# EAGLE design TickTagREV4 (EAGLE 9.5.2)
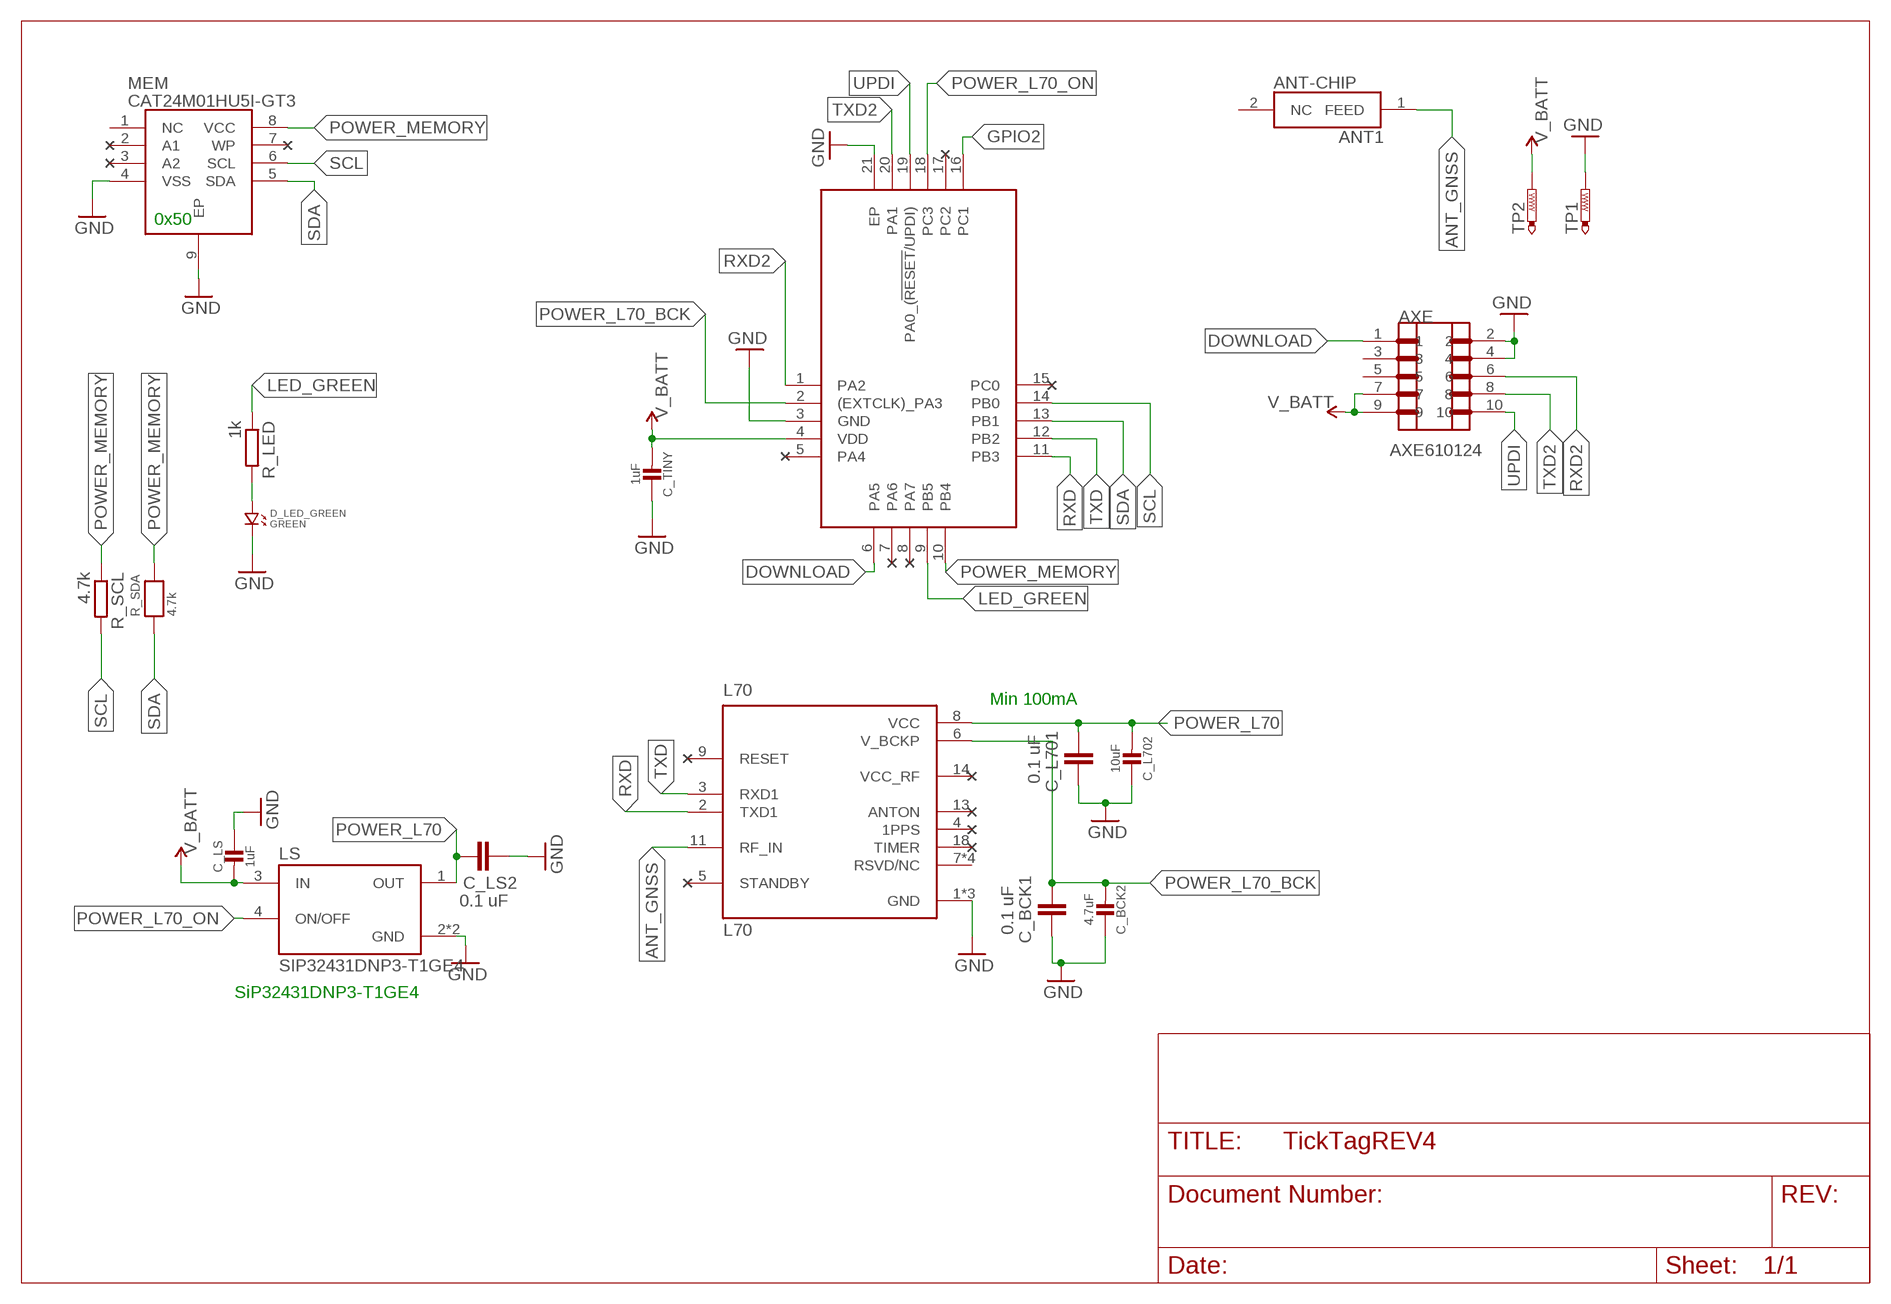
[diagram p0: schematic, sheet 1]

## Parts
ANT-CHIP  ANT1  SAMACSYS_PARTS_1575AT43A0040E  [SAMACSYS_PARTS_1575AT43A0040E]
ATTINY  ATTINY1616-MFR  [QFN40P300X300X90-21N]
AXE  AXE610124  [AXE610124]
C_BCK1  0.1 uF  C-EUC0201  [C0201]
C_BCK2  4.7uF  MICROBUILDER_CAP_CERAMIC_0402MP  [MICROBUILDER__0402MP]
C_L701  0.1 uF  C-EUC0201  [C0201]
C_L702  10uF  MICROBUILDER_CAP_CERAMIC_0402MP  [MICROBUILDER__0402MP]
C_LS  1uF  MICROBUILDER_CAP_CERAMIC_0402MP  [MICROBUILDER__0402MP]
C_LS2  0.1 uF  C-EUC0201  [C0201]
C_TINY  1uF  MICROBUILDER_CAP_CERAMIC_0402MP  [MICROBUILDER__0402MP]
D_LED_GREEN  GREEN  CMONR_STANDARDPARTS_LED.0402  [CMONR_STANDARDPARTS_0402.LED]
L70  L70  [XCVR_L70]
LS  SIP32431DNP3-T1GE4  [SON50P120X160X60-5N]
MEM  CAT24M01HU5I-GT3  [SON50P300X200X55-9N]
R_LED  1k  R-EU_R0201  [R0201]
R_SCL  4.7k  R-EU_R0201  [R0201]
R_SDA  4.7k  MICROBUILDER_RESISTOR_0402MP  [MICROBUILDER__0402MP]
TP1  PTR1TP13SQ  [TP13SQ]
TP2  PTR1TP13SQ  [TP13SQ]

## Nets
ANT_GNSS: ANT-CHIP.1(FEED) L70.11(RF_IN)
DOWNLOAD: ATTINY.6(PA5) AXE.1
GND: ATTINY.3(GND) ATTINY.21(EP) AXE.2 AXE.4 C_BCK1.2 C_BCK2.1 C_L701.2 C_L702.1 C_LS2.2 C_LS.1 C_TINY.1 D_LED_GREEN.P$2 L70.1(GND) L70.10(GND) L70.12(GND) LS.2(GND) LS.5(GND) MEM.4(VSS) MEM.9(EP) TP1.TP
GPIO2: ATTINY.16(PC1)
LED_GREEN: ATTINY.9(PB5) R_LED.1
N$9: D_LED_GREEN.P$1 R_LED.2
POWER_L70: C_L701.1 C_L702.2 C_LS2.1 L70.8(VCC) LS.1(OUT)
POWER_L70_BCK: ATTINY.2((EXTCLK)_PA3) C_BCK1.1 C_BCK2.2 L70.6(V_BCKP)
POWER_L70_ON: ATTINY.18(PC3) LS.4(ON/OFF)
POWER_MEMORY: ATTINY.10(PB4) MEM.8(VCC) R_SCL.1 R_SDA.2
RXD: ATTINY.11(PB3) L70.2(TXD1)
RXD2: ATTINY.1(PA2) AXE.6
SCL: ATTINY.14(PB0) MEM.6(SCL) R_SCL.2
SDA: ATTINY.13(PB1) MEM.5(SDA) R_SDA.1
TXD: ATTINY.12(PB2) L70.3(RXD1)
TXD2: ATTINY.20(PA1) AXE.8
UPDI: ATTINY.19(PA0_(!RESET!/UPDI)) AXE.10
V_BATT: ATTINY.4(VDD) AXE.7 AXE.9 C_LS.2 C_TINY.2 LS.3(IN) TP2.TP
Unconnected: ANT-CHIP.2(NC) ATTINY.5(PA4) ATTINY.7(PA6) ATTINY.8(PA7) ATTINY.15(PC0) ATTINY.17(PC2) AXE.3 AXE.5 L70.4(1PPS) L70.5(STANDBY) L70.7(RSVD/NC) L70.9(RESET) L70.13(ANTON) L70.14(VCC_RF) L70.15(RSVD/NC) L70.16(RSVD/NC) L70.17(RSVD/NC) L70.18(TIMER) MEM.1(NC) MEM.2(A1) MEM.3(A2) MEM.7(WP)

## Notes on the sheet
- 0x50
- Min 100mA
- SiP32431DNP3-T1GE4

## Library data of the parts
ANT-CHIP = 1575AT43A0040E_V2:SAMACSYS_PARTS_1575AT43A0040E: Tri-Band GPS, BDS, and GLNSS, Low Cost, Linearly Polarized, Omnidirectional Chip Antenna Source: Datasheet <https://componentsearchengine.com/Datasheets/1/1575AT43A0040E.pdf>; DESCRIPTION: Tri-Band GPS, BDS, and GLNSS, Low Cost, Linearly Polarized, Omnidirectional Chip Antenna; HEIGHT: mm; MANUFACTURER_NAME: JOHANSON TECHNOLOGY; MANUFACTURER_PART_NUMBER: 1575AT43A0040E; MOUSER_PART_NUMBER: 609-1575AT43A0040E; MOUSER_PRICE-STOCK: https://www.mouser.com/Search/Refine.aspx?Keyword=609-1575AT43A0040E
ATTINY = ATTINY1616-MFR:ATTINY1616-MFR: 8-bit Microcontrollers - MCU 20MHz, 16KB, VQFN20, Ind 125C, Green, T&R Source: Datasheet <http://ww1.microchip.com/downloads/en/DeviceDoc/ATtiny806_1606_Data_Sheet_40002029A.pdf>; DESCRIPTION: 8-bit Microcontrollers - MCU 20MHz, 16KB, VQFN20, Ind 125C, Green, T&R; HEIGHT: 0.9mm; MANUFACTURER_NAME: Microchip; MANUFACTURER_PART_NUMBER: ATTINY1606-MFR; MOUSER_PART_NUMBER: 556-ATTINY1606-MFR; MOUSER_PRICE-STOCK: https://www.mouser.com/Search/Refine.aspx?Keyword=556-ATTINY1606-MFR
AXE = PanasonicA4SConnectorsV7:AXE610124
C_BCK1 C_L701 C_LS2 = rcl:C-EU: CAPACITOR, European symbol; SPICEPREFIX: C
C_BCK2 C_L702 C_LS C_TINY = TinyPICO:MICROBUILDER_CAP_CERAMIC: Ceramic Capacitors For new designs, use the packages preceded by an '_' character since they are more reliable: The following footprints should be used on most boards: _0402 - Standard footprint for regular board layouts _0603 - Standard footprint for regular board layouts _0805 - Standard footprint for regular board layouts _1206 - Standard footprint for regular board layouts For extremely tight-pitch boards where space is at a premium, the following 'micro-pitch' footprints can be used (smaller pads, no silkscreen outline, etc.): _0402MP - Micro-pitch footprint for very dense/compact boards _0603MP - Micro-pitch footprint for very dense/compact boards _0805MP - Micro-pitch footprint for very dense/compact boards _1206MP - Micro-pitch footprint for very dense/compact boards
D_LED_GREEN = TinyPICO:CMONR_STANDARDPARTS_LED
L70 = L70LessCream:L70: GPS Module Check prices <https://snapeda.com/parts/L70/Quectel/view-part/?ref=eda>; AVAILABILITY: Bad; DESCRIPTION: L70, an SMD type module, brings the high performance of MTK positioning engine to the industrial applications with compact profile, ultra low power consumption and fast positioning capability.; MF: Quectel; MP: L70; PACKAGE: 2920 Quectel; PRICE: None
LS = SIP32431DNP3-T1GE4:SIP32431DNP3-T1GE4: Power Switch/Driver 1:1 P-Channel 1.4A 4-TDFN (1.2x1.6) Check prices <https://pricing.snapeda.com/parts/SIP32431DNP3-T1GE4/Vishay%20Siliconix/view-part?ref=eda>; AVAILABILITY: In Stock; DESCRIPTION: Power Switch/Driver 1:1 P-Channel 1.4A 4-TDFN (1.2x1.6); MF: Vishay Siliconix; MP: SIP32431DNP3-T1GE4; PACKAGE: UFDFN-4 Vishay Siliconix; PRICE: None; PURCHASE-URL: https://pricing.snapeda.com/search/part/SIP32431DNP3-T1GE4/?ref=eda
MEM = CAT24M01HU5I-GT3-CorrectedV2:CAT24M01HU5I-GT3: EEPROM 1MB I2C SERIAL EEPROM Source: Datasheet <http://www.onsemi.com/pub/Collateral/CAT24M01-D.PDF>; ALLIED_NUMBER: 70300250; ALLIED_PRICE-STOCK: http://www.alliedelec.com/on-semiconductor-cat24m01hu5i-gt3/70300250/; DESCRIPTION: EEPROM 1MB I2C SERIAL EEPROM; HEIGHT: 0.55mm; MANUFACTURER_NAME: ON Semiconductor; MANUFACTURER_PART_NUMBER: CAT24M01HU5I-GT3; MOUSER_PART_NUMBER: 863-CAT24M01HU5I-GT3; MOUSER_PRICE-STOCK: https://www.mouser.com/Search/Refine.aspx?Keyword=863-CAT24M01HU5I-GT3; RS_PART_NUMBER: 7814831P; RS_PRICE-STOCK: http://uk.rs-online.com/web/p/products/7814831P
R_LED R_SCL = rcl:R-EU_: RESISTOR, European symbol; SPICEPREFIX: R
R_SDA = TinyPICO:MICROBUILDER_RESISTOR: Resistors 0402 - 0402 Surface Mount Package 22 Ohm 1% 1/16W [Digikey: 311-22.0LRTR-ND] 33 Ohm 5% 1/16W 1.0K 5% 1/16W 1.5K 5% 1/16W 2.0K 1% 1/16W 10.0K 1% 1/16W [Digikey: 311-10.0KLRTR-ND] 10.0K 5% 1/16W [Digikey: RMCF0402JT10K0TR-ND] 12.1K 1% 1/16W [Digikey: 311-22.0LRTR-ND] 100.0K 5% 1/16W 0603 - 0603 Surface Mount Package 0 Ohm 1/10 Watt 1% Resistor 15 Ohm 1/10 Watt 1% Resistor 33 Ohm 1/10 Watt 1% Resistor 49.9 Ohm 1/10 Watt 1% Resistor 100 Ohm 1/10 Watt 1% Resistor 150 Ohm 1/10 Watt 1% Resistor 240 Ohm 1/10 Watt 1% Resistor 390 Ohm 1/10 Watt 1% Resistor 560 Ohm 1/10 Watt 1% Resistor 680 Ohm 1/10 Watt 1% Resistor 750 Ohm 1/10 Watt 1% Resistor 1.0K Ohm 1/10 Watt 1% Resistor 1.5K Ohm 1/10 Watt 1% Resistor 2.0K Ohm 1/10 Watt 1% Resistor 2.2K Ohm 1/10 Watt 1% Resistor 3.3K Ohm 1/10 Watt 1% Resistor 4.7K Ohm 1/10 Watt 1% Resistor 10.0K Ohm 1/10 Watt 1% Resistor 12.0K Ohm 1/10 Watt 1% Resistor 12.1K Ohm 1/10 Watt 1% Resistor 20.0K Ohm 1/10 Watt 1% Resistor 33.0K Ohm 1/10 Watt 1% Resistor 100.0K Ohm 1/10 Watt 1% Resistor 0805 - 0805 Surface Mount Package 0 Ohm 1/8 Watt 1% Resistor 33 Ohm 1/8 Watt 1% Resistor 100 Ohm 1/8 Watt 1% Resistor 150 Ohm 1/8 Watt 1% Resistor 200 Ohm 1/8 Watt 1% Resistor 240 Ohm 1/8 Watt 1% Resistor 330 Ohm 1/8 Watt 1% Resistor 390 Ohm 1/8 Watt 1% Resistor 470 Ohm 1/8 Watt 1% Resistor 1.0K Ohm 1/8 Watt 1% Resistor 1.5K Ohm 1/8 Watt 1% Resistor 2.0K Ohm 1/8 Watt 1% Resistor 4.7K Ohm 1/8 Watt 1% Resistor 5.1K Ohm 1/8 Watt 1% Resistor 5.6K Ohm 1/8 Watt 1% Resistor 10.0K Ohm 1/8 Watt 1% Resistor 22.0K Ohm 1/8 Watt 1% Resistor 33.0K Ohm 1/8 Watt 1% Resistor 100K Ohm 1/8 Watt 1% Resistor 1206 - 1206 Surface Mount Package 2012 - 2010 Surface Mount Package 0.11 Ohm 1/2 Watt 1% Resistor - Digikey: RHM.11UCT-ND
TP1 TP2 = testpad:PTR1: TEST PIN

## Board
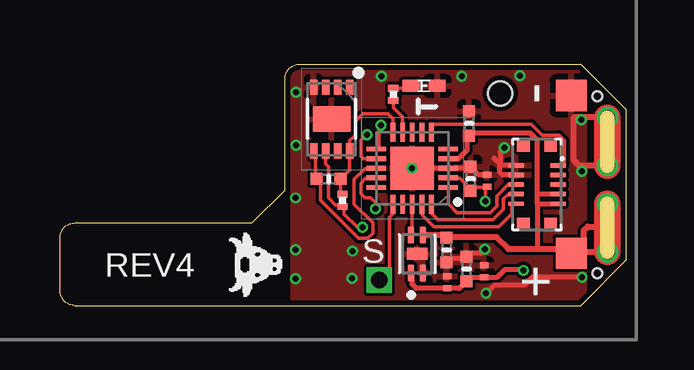
[diagram p1: board, top side]
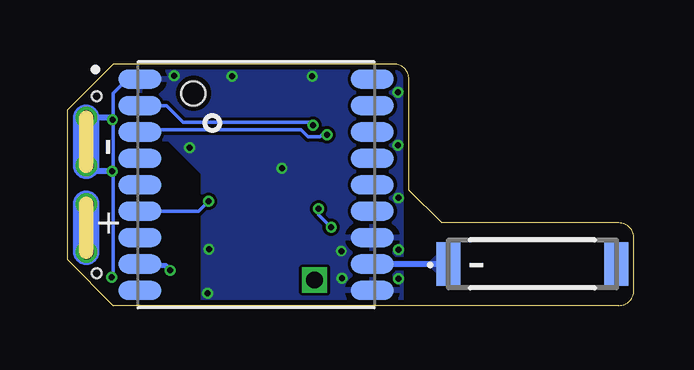
[diagram p2: board, bottom side, seen from below]

Size 23.61 x 10.06 mm. Coordinates in mm from the lower left corner, seen from the top.
Outline: 10,10.06 21.71,10.06 23.61,8.16 23.61,1.9 21.71,0 0.62,0 arc-90 0,0.62 0,2.82 arc-90 0.62,3.44 8.01,3.44 9.38,4.81 9.38,9.44 arc-90 10,10.06
Copper layers (1*16): Top 0.0356mm / dielectric 0.13mm / Bottom 0.0356mm
Design rules "default *": minimum track width 5mil, minimum drill 0.25mm, track to track 5mil, track to pad 5mil, pad to pad 5mil, via to via 5mil, smd to smd 5mil, copper to edge 9mil, drill to drill 6mil, minimum pad ring 4mil, minimum via ring 4mil, stop-mask expansion 0mil, vias tented up to drill 0.35mm, thermal gap 10mil
Holes 1 mm at 18.36,8.84
Holes 0.4 mm at 22.4,1.35 22.4,8.71
Milling: 2 lines

### Footprints (pad centres in the part's own frame; a part is rotated, then mirrored left to right if it is on the bottom)
SAMACSYS_PARTS_1575AT43A0040E = smd 1 x 1.8: 1 3.5,0; 2 -3.5,0
QFN40P300X300X90-21N = smd 0.8 x 0.2: 1 -1.5,0.8; 2 -1.5,0.4; 3 -1.5,0; 4 -1.5,-0.4; 5 -1.5,-0.8; 11 1.5,-0.8; 12 1.5,-0.4; 13 1.5,0; 14 1.5,0.4; 15 1.5,0.8 | smd 0.2 x 0.8: 6 -0.8,-1.5; 7 -0.4,-1.5; 8 0,-1.5; 9 0.4,-1.5; 10 0.8,-1.5; 16 0.8,1.5; 17 0.4,1.5; 18 0,1.5; 19 -0.4,1.5; 20 -0.8,1.5 | smd 1.8 x 1.8: 21 0,0
AXE610124 = smd 0.2 x 0.65: 1 0.81,-0.88; 2 0.81,0.87; 3 0.41,-0.88; 4 0.41,0.87; 5 0.01,-0.88; 6 0.01,0.87; 7 -0.39,-0.88; 8 -0.39,0.87; 9 -0.79,-0.88; 10 -0.79,0.87 | smd 0.45 x 0.53: DNC1 -1.59,0.57; DNC2 -1.59,-0.569; DNC3 1.607,-0.569; DNC4 1.607,0.57
C0201 = smd 0.25 x 0.35: 1 -0.25,0; 2 0.25,0
MICROBUILDER__0402MP = smd 0.5 x 0.5: 1 -0.508,0; 2 0.508,0
CMONR_STANDARDPARTS_0402.LED = smd 0.7 x 0.5: P$1 -0.55,0; P$2 0.55,0
XCVR_L70 = smd 1.8 x 0.8: 1 -4.85,4.4; 2 -4.85,3.3; 3 -4.85,2.2; 4 -4.85,1.1; 5 -4.85,0; 6 -4.85,-1.1; 7 -4.85,-2.2; 8 -4.85,-3.3; 9 -4.85,-4.4; 10 4.85,-4.4; 11 4.85,-3.3; 12 4.85,-2.2; 13 4.85,-1.1; 14 4.85,0; 15 4.85,1.1; 16 4.85,2.2; 17 4.85,3.3; 18 4.85,4.4
SON50P120X160X60-5N = smd 0.71 x 0.27: 1 -0.795,0.25; 2 -0.795,-0.25; 3 0.795,-0.25; 4 0.795,0.25 | smd 0.5 x 0.86: 5 0,0
SON50P300X200X55-9N = smd 0.63 x 0.32: 1 -1.33,0.75; 2 -1.33,0.25; 3 -1.33,-0.25; 4 -1.33,-0.75; 5 1.33,-0.75; 6 1.33,-0.25; 7 1.33,0.25; 8 1.33,0.75 | smd 1.06 x 1.56: 9 0,0
R0201 = smd 0.28 x 0.43: 1 -0.255,0; 2 0.255,0
TP13SQ = smd 1.3 x 1.3: TP 0,0

### Placement (x,y rotation side)
ANT-CHIP  4.23,1.73 180 bottom
ATTINY  14.69,5.72 180 top
AXE  19.89,5.03 90 top
C_BCK1  17.81,5.2 90 top
C_BCK2  17.12,5.28 270 top
C_L701  17.68,1.43 90 top
C_L702  16.95,1.52 270 top
C_LS  16.12,2.32 90 top
C_LS2  16.14,0.97 90 top
C_TINY  17.06,7.59 270 top
D_LED_GREEN  15.18,9.15 0 top
L70  15.75,5.03 0 bottom
LS  14.89,2.15 90 top
MEM  11.33,7.77 270 top
R_LED  13.9,8.8 90 top
R_SCL  11.78,4.38 270 top
R_SDA  11.2,5.28 0 top
TP1  21.32,8.75 0 top
TP2  21.32,2.18 0 top

### Tracks (layer width: path | path; a pad name or v marks a point on that pad's centre or on a via)
ANT_GNSS
  Bottom 0.25: L70.11 ANT-CHIP.1
  pour Bottom (no thermals): 8.23,2.12 8.5,1.85 8.5,1.61 8.23,1.34
DOWNLOAD
  Top 0.152: ATTINY.6 15.49,7.48 15.57,7.56 19.66,7.56 20.12,7.09 20.82,7.09 21.03,6.89 21.03,5.87 21,5.84 AXE.1
GND  (via drill 0.25, 0.6)
  Top 0.2: v14.68,5.72 ATTINY.3 17.05,5.72 C_BCK2.1 17.46,5.45 C_BCK1.2 | 18.35,5.84 AXE.2 | 18.1,6.15 18.27,5.98 18.35,5.98 18.35,5.84 | AXE.4 18.44,5.44 18.35,5.53 18.35,5.84 | 18.35,5.84 18.36,5.85 18.36,6.41 v18.53,6.58 | C_LS.1 16.26,1.95 16.87,1.95 C_L702.1 17.09,2.17 17.54,2.17 v17.72,2.35 | v17.77,0.51 18.11,0.85 19.37,0.85 19.69,1.17 v21.77,1.17
  Top 0.254: v22.83,5.83 21.65,5.83 21.43,6.05 21.43,7.84 v22.82,7.84 v22.83,7.83
  Top 1.1: v22.83,5.83 v22.83,7.83
  Bottom 0.152: L70.1 21.12,9.43 21.71,8.84 21.71,1.23 v21.77,1.17
  Bottom 0.254: v21.74,7.74 21.83,7.83 v22.83,7.83 | v21.76,5.59 22.59,5.59 v22.83,5.83
  Bottom 1.1: v22.83,7.83 v22.83,5.83
  other vias: 12.17,1.13 12.2,2.27 13.41,9.55 16.75,9.55 9.82,2.33 9.82,1.12 9.82,4.48 9.84,6.68 9.84,8.88 19.17,9.58
  pour Top: 9.67,10.59 9.67,-0.49 21.91,-0.49 21.91,10.59
  pour Bottom: 9.67,-0.38 9.67,10.59 20.62,10.59 20.62,7.77 19.76,6.91 19.4,6.91 17.98,5.49 17.98,-0.38
  cutout Bottom: 9.4,2.01 10.07,2.01 10.07,1.46 9.4,1.46
GPIO2  (via drill 0.7)
  Top 0.152: v13.31,1.06 13.73,1.48 13.73,3.67 13.87,3.81 13.87,4.2 ATTINY.16
LED_GREEN
  Top 0.152: ATTINY.9 14.29,7.86 13.9,8.24 R_LED.1
N$9
  Top 0.152: R_LED.2 14.54,9.05 D_LED_GREEN.P$1
POWER_L70  (via drill 0.25)
  Top 0.2: LS.1 14.67,1.32 14.67,0.9 14.86,0.71 C_LS2.1 16.65,0.71 C_L702.2 17.09,1.15 17.65,1.15 C_L701.1 18.24,1.18 18.56,1.5 19.29,1.5 v19.33,1.46
  Bottom 0.2: v19.33,1.46 19.54,1.67 20.54,1.67 L70.8
POWER_L70_BCK  (via drill 0.25)
  Top 0.152: ATTINY.2 16.21,5.3 16.67,5.3 17.12,4.85 C_BCK2.2 17.28,4.93 17.79,4.93 C_BCK1.1 17.73,4.87 v17.73,4.34
  Bottom 0.152: v17.73,4.34 18.14,3.93 L70.6
POWER_L70_ON
  Top 0.152: ATTINY.18 14.68,2.98 LS.4
POWER_MEMORY
  Top 0.152: ATTINY.10 13.89,7.79 13.68,8 12.64,8 12.32,7.68 12.32,7.1 12.08,6.87 MEM.8 12.07,5.65 R_SDA.2 11.71,4.63 R_SCL.1
RXD  (via drill 0.25)
  Top 0.152: v13.38,7.51 13.31,7.44 13.31,6.52 ATTINY.11
  Bottom 0.152: L70.2 19.49,8.33 18.79,7.63 13.5,7.63 v13.38,7.51
RXD2
  Top 0.152: ATTINY.1 16.19,4.23 16.56,3.86 17.94,3.86 18.21,4.13 18.21,4.56 18.68,5.03 AXE.6
SCL  (via drill 0.25)
  Top 0.152: MEM.6 11.08,5.9 11.2,5.78 11.2,4.48 11.5,4.18 11.72,4.18 R_SCL.2 11.85,4.05 11.85,3.81 12.4,3.26 v12.62,3.26 | v13.15,4.03 13.15,4.3 12.95,4.5 12.73,4.5 12.56,4.67 12.56,5.1 12.75,5.29 13.18,5.29 13.19,5.3 ATTINY.14
  Bottom 0.152: v13.15,4.03 13.15,3.79 v12.62,3.26
SDA
  Top 0.152: MEM.5 10.66,6.36 10.66,5.31 R_SDA.1 10.86,5.07 10.86,4.38 12.45,2.8 12.83,2.8 13.05,3.02 13.05,3.44 12.27,4.23 12.27,5.26 12.72,5.7 13.17,5.7 ATTINY.13
TXD  (via drill 0.25)
  Top 0.152: ATTINY.12 12.66,6.12 12.56,6.22 12.56,6.9 v12.8,7.12
  Bottom 0.152: v12.8,7.12 13.01,7.12 13.08,7.03 13.58,7.03 13.88,7.33 20.5,7.33 L70.3
TXD2
  Top 0.152: AXE.8 18.69,4.64 18.49,4.44 18.49,4.02 18.05,3.57 15.77,3.57 15.49,3.85 ATTINY.20
UPDI
  Top 0.152: AXE.10 18.85,4.24 18.85,3.83 18.31,3.29 15.58,3.29 15.12,3.75 15.12,4.19 ATTINY.19
V_BATT  (via drill 0.6)
  Top 0.2: 19.9,4.24 19.9,2.36 | 19.9,4.24 AXE.9 | 19.9,4.24 19.9,4.64 | 19.9,4.64 19.9,6.89 19.6,7.19 17.17,7.19 C_TINY.2 16.97,6.99 16.97,6.46 16.62,6.11 ATTINY.4 | AXE.7 19.9,4.64
  Top 0.254: LS.3 16,2.94 C_LS.2 16.14,2.85 18.2,2.85 18.69,2.36 19.9,2.36 21.14,2.36 TP2.TP | v22.83,2.23 21.4,2.23 21.35,2.18 TP2.TP | TP2.TP 21.84,2.7 21.84,3.13 22,3.29 22.83,3.29
  Top 1.1: v22.83,4.23 22.83,3.29 v22.83,2.23
  Bottom 1.1: v22.83,4.23 v22.83,2.23

### Text on the board
tNames: - | S | REV4 | +
bNames: - | + | -
tDocu: Ear-Tag Housing 22 x 35mm